# EAGLE design bluz_gw_shield_v1 (EAGLE 7.3.0)
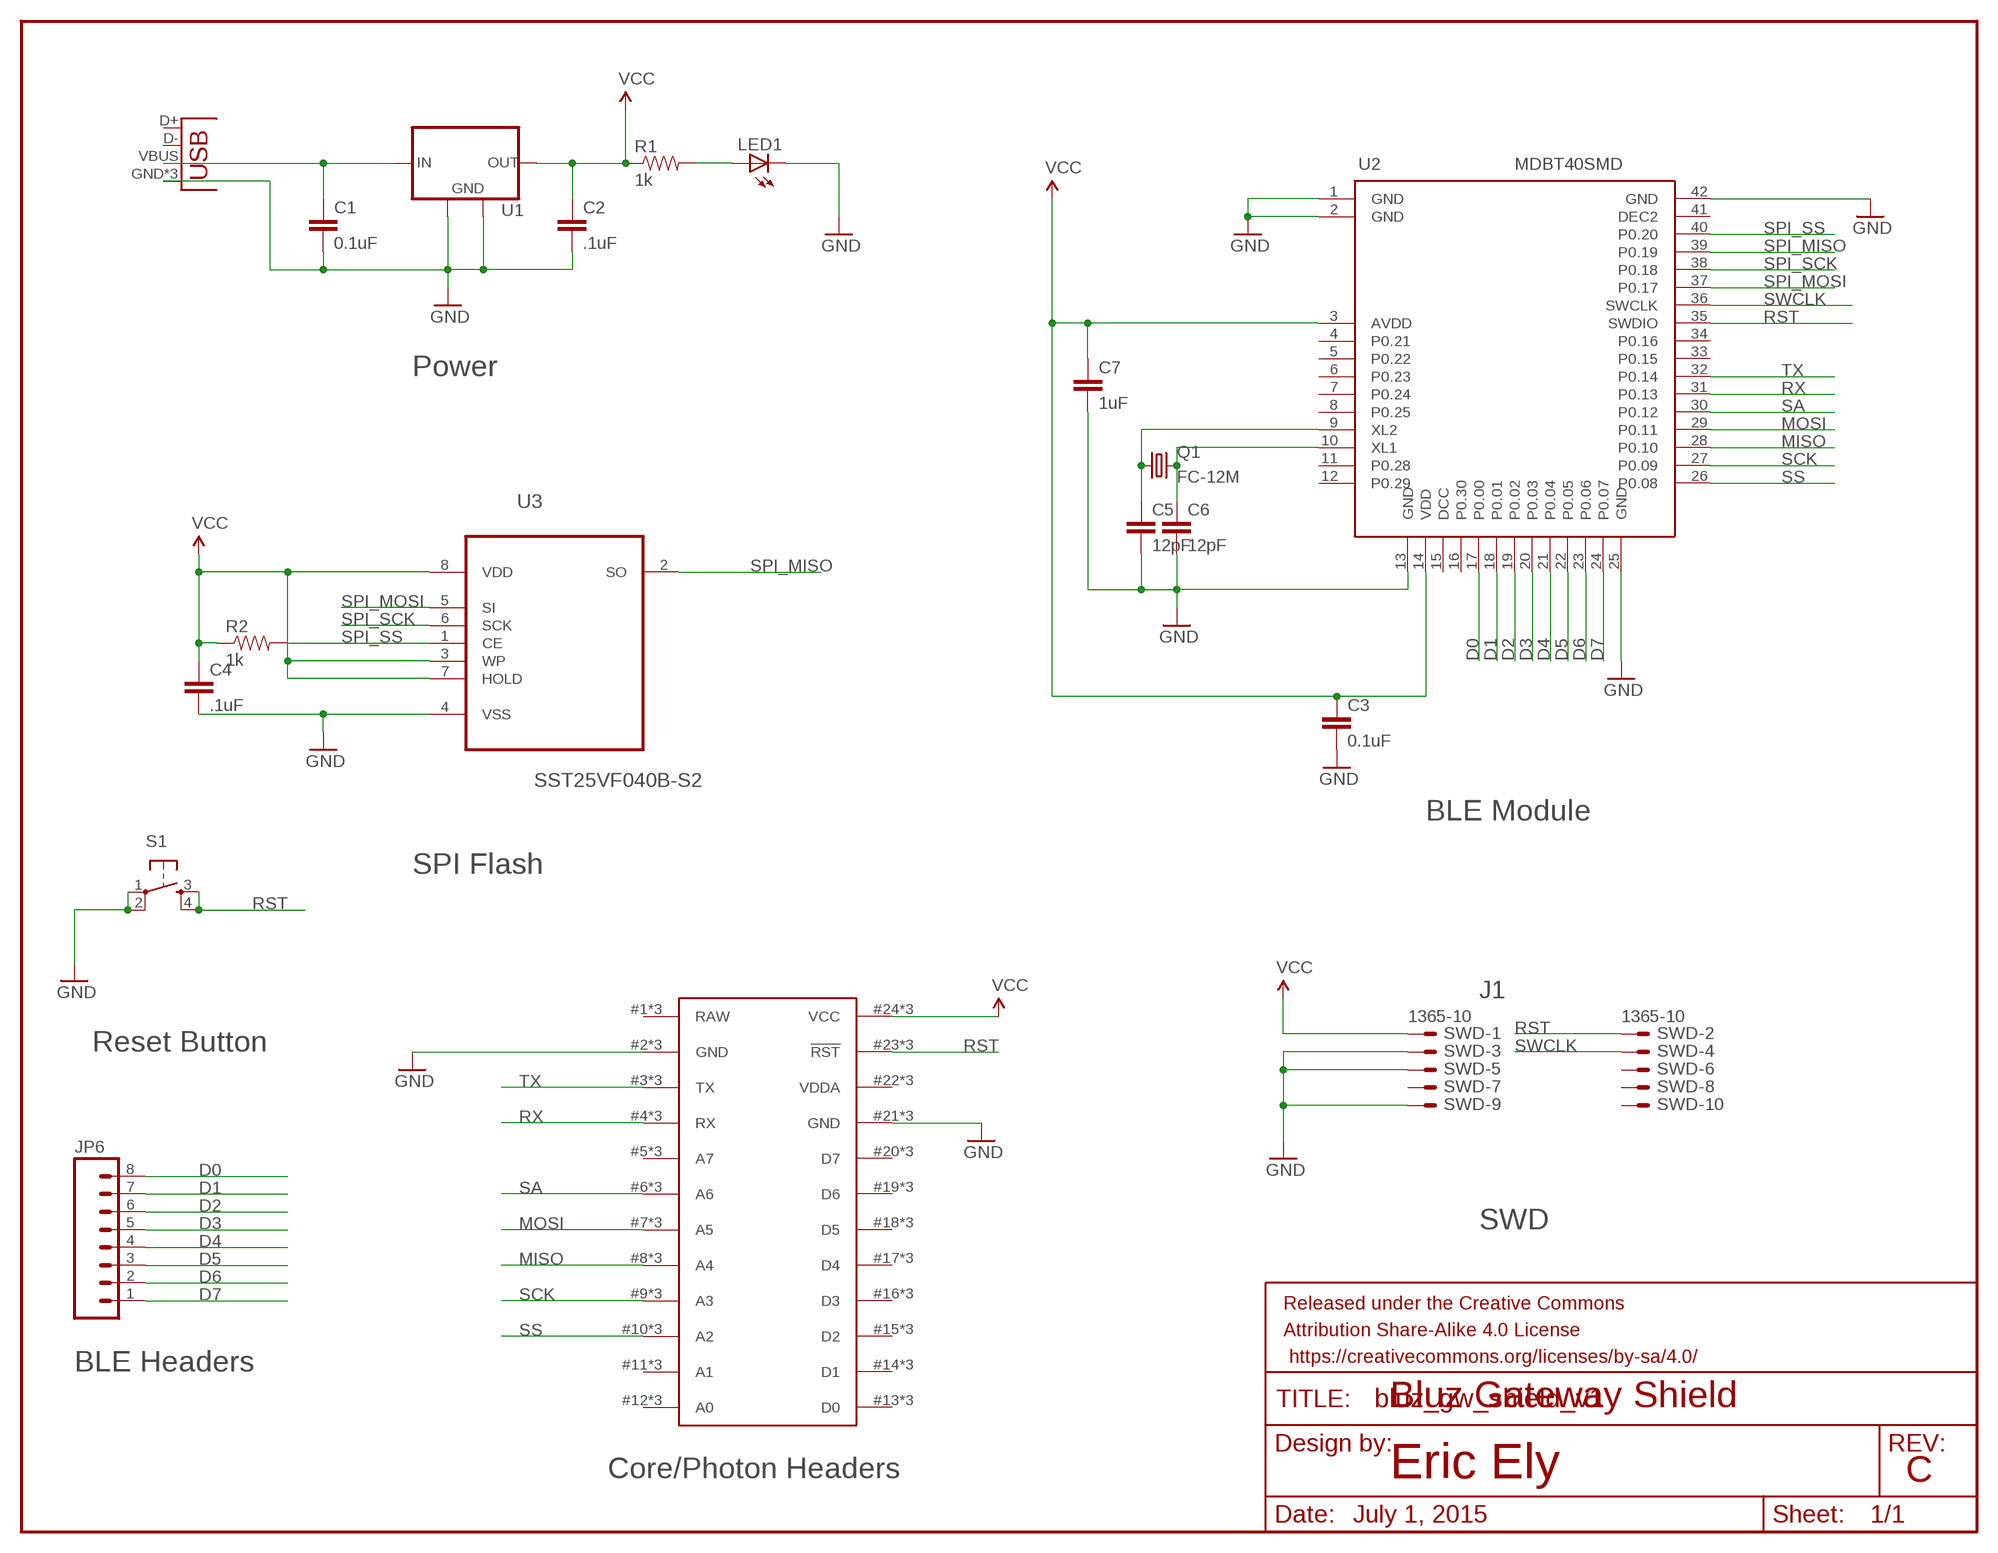
[diagram p0: schematic, sheet 1]

## Parts
C1  0.1uF  CAP0603-CAP  [0603-CAP]
C2  .1uF  CAP0603-CAP  [0603-CAP]
C3  0.1uF  CAP0603-CAP  [0603-CAP]
C4  .1uF  CAP0603-CAP  [0603-CAP]
C5  12pF  CAP0603-CAP  [0603-CAP]
C6  12pF  CAP0603-CAP  [0603-CAP]
C7  1uF  CAP0603-CAP  [0603-CAP]
FRAME1  FRAME-LETTER  [CREATIVE_COMMONS]
J2  USB-MICROB  [USB-MICROB]
JP6  M081X08  [1X08]
LED1  LEDCHIP-LED0603  [CHIP-LED0603]
Q1  FC-12M  [FC-12M]
R1  1k  RESISTOR0603-RES  [0603-RES]
R2  1k  RESISTOR0603-RES  [0603-RES]
S1  TAC_SWITCHSMD  [TACTILE_SWITCH_SMD]
SWD  1365-10  [1365-10]
U1  MCP1825S-SOT223  [SOT223]
U2  MDBT40SMD  [MDBT40]
U3  SST25VF040B-S2  [SOIC127P790X216-8N]
U4  SPARK_CORE  [SPARK_CORE_STACKABLE]

## Nets
D0: JP6.8 U2.17(P0.00)
D1: JP6.7 U2.18(P0.01)
D2: JP6.6 U2.19(P0.02)
D3: JP6.5 U2.20(P0.03)
D4: JP6.4 U2.21(P0.04)
D5: JP6.3 U2.22(P0.05)
D6: JP6.2 U2.23(P0.06)
D7: JP6.1 U2.24(P0.07)
GND: C1.2 C2.2 C3.2 C4.2 C5.2 C6.2 C7.2 J2.GND J2.MT1(GND) J2.MT2(GND) LED1.C S1.1 S1.2 SWD.3 SWD.5 SWD.9 U1.2(GND) U1.4(GND) U2.1(GND) U2.2(GND) U2.13(GND) U2.25(GND) U2.42(GND) U3.4(VSS) U4.2(GND) U4.21(GND) U4.#2(GND) U4.#21(GND) U4.@2(GND) U4.@21(GND)
MISO: U2.28(P0.10) U4.8(A4) U4.#8(A4) U4.@8(A4)
MOSI: U2.29(P0.11) U4.7(A5) U4.#7(A5) U4.@7(A5)
N$1: C1.1 J2.VBUS U1.1(IN)
N$5: LED1.A R1.2
N$7: C5.1 Q1.1 U2.9(XL2)
N$8: C6.1 Q1.2 U2.10(XL1)
RST: S1.3 S1.4 SWD.2 U2.35(SWDIO) U4.23(!RST) U4.#23(!RST) U4.@23(!RST)
RX: U2.31(P0.13) U4.4(RX) U4.#4(RX) U4.@4(RX)
SA: U2.30(P0.12) U4.6(A6) U4.#6(A6) U4.@6(A6)
SCK: U2.27(P0.09) U4.9(A3) U4.#9(A3) U4.@9(A3)
SPI_MISO: U2.39(P0.19) U3.2(SO)
SPI_MOSI: U2.37(P0.17) U3.5(SI)
SPI_SCK: U2.38(P0.18) U3.6(SCK)
SPI_SS: R2.2 U2.40(P0.20) U3.1(CE)
SS: U2.26(P0.08) U4.10(A2) U4.#10(A2) U4.@10(A2)
SWCLK: SWD.4 U2.36(SWCLK)
TX: U2.32(P0.14) U4.3(TX) U4.#3(TX) U4.@3(TX)
VCC: C2.1 C3.1 C4.1 C7.1 R1.1 R2.1 SWD.1 U1.3(OUT) U2.3(AVDD) U2.14(VDD) U3.3(WP) U3.7(HOLD) U3.8(VDD) U4.24(VCC) U4.#24(VCC) U4.@24(VCC)
Unconnected: J2.D+ J2.D- SWD.6 SWD.7 SWD.8 SWD.10 U2.4(P0.21) U2.5(P0.22) U2.6(P0.23) U2.7(P0.24) U2.8(P0.25) U2.11(P0.28) U2.12(P0.29) U2.15(DCC) U2.16(P0.30) U2.33(P0.15) U2.34(P0.16) U2.41(DEC2) U4.5(A7) U4.11(A1) U4.12(A0) U4.13(D0) U4.14(D1) U4.15(D2) U4.16(D3) U4.17(D4) U4.18(D5) U4.19(D6) U4.20(D7) U4.#5(A7) U4.#11(A1) U4.#12(A0) U4.#13(D0) U4.#14(D1) U4.#15(D2) U4.#16(D3) U4.#17(D4) U4.#18(D5) U4.#19(D6) U4.#20(D7) U4.@5(A7) U4.@11(A1) U4.@12(A0) U4.@13(D0) U4.@14(D1) U4.@15(D2) U4.@16(D3) U4.@17(D4) U4.@18(D5) U4.@19(D6) U4.@20(D7)

## Notes on the sheet
- Power
- BLE Module
- SPI Flash
- J1
- Reset Button
- SWD
- BLE Headers
- Bluz Gateway Shield
- Core/Photon Headers | Eric Ely | C
- July 1, 2015

## Power pins joined to a net without a drawn wire
RAW: U4.1(RAW) U4.#1(RAW) U4.@1(RAW)
VDDA: U4.22(VDDA) U4.#22(VDDA) U4.@22(VDDA)

## Library data of the parts
C1 C5 C6 = SparkFun-Passives:CAP: Capacitor Standard 0603 ceramic capacitor, and 0.1" leaded capacitor.
C2-C4 C7 = SparkFun-Capacitors:CAP: Capacitor Standard 0603 ceramic capacitor, and 0.1" leaded capacitor.
FRAME1 = SparkFun-Aesthetics:FRAME-LETTER: Schematic Frame Standard 8.5x11 US Letter frame
J2 = SparkFun-Connectors:USB: USB Connectors USB-B-PTH is fully proven SKU : PRT-00139/CONN-08278 USB-miniB is fully proven SKU : PRT-00587 USB-A-PCB is untested. USB-A-H is throughly reviewed, but untested. Spark Fun Electronics SKU : PRT-00437 USB-B-SMT is throughly reviewed, but untested. Needs silkscreen touching up. USB-A-S has not been used/tested USB-MB-H has not been used/tested USB-MICROB has been used. CONN-09505; PROD_ID: CONN-09505
JP6 = SparkFun-Connectors:M08: Header 8 Standard 8-pin 0.1" header. Use with straight break away headers (SKU : PRT-00116), right angle break away headers (PRT-00553), swiss pins (PRT-00743), machine pins (PRT-00117), and female headers (PRT-00115).
LED1 = led:LED: LED OSRAM: - CHIPLED LG R971, LG N971, LY N971, LG Q971, LY Q971, LO R971, LY R971 LH N974, LH R974 LS Q976, LO Q976, LY Q976 LO Q996 - Hyper CHIPLED LW Q18S LB Q993, LB Q99A, LB R99A - SideLED LS A670, LO A670, LY A670, LG A670, LP A670 LB A673, LV A673, LT A673, LW A673 LH A674 LY A675 LS A676, LA A676, LO A676, LY A676, LW A676 LS A679, LY A679, LG A679 - Hyper Micro SIDELED® LS Y876, LA Y876, LO Y876, LY Y876 LT Y87S - SmartLED LW L88C, LW L88S LB L89C, LB L89S, LG L890 LS L89K, LO L89K, LY L89K LS L896, LA L896, LO L896, LY L896 - TOPLED LS T670, LO T670, LY T670, LG T670, LP T670 LSG T670, LSP T670, LSY T670, LOP T670, LYG T670 LG T671, LOG T671, LSG T671 LB T673, LV T673, LT T673, LW T673 LH T674 LS T676, LA T676, LO T676, LY T676, LB T676, LH T676, LSB T676, LW T676 LB T67C, LV T67C, LT T67C, LS T67K, LO T67K, LY T67K, LW E67C LS E67B, LA E67B, LO E67B, LY E67B, LB E67C, LV E67C, LT E67C LW T67C LS T679, LY T679, LG T679 LS T770, LO T770, LY T770, LG T770, LP T770 LB T773, LV T773, LT T773, LW T773 LH T774 LS E675, LA E675, LY E675, LS T675 LS T776, LA T776, LO T776, LY T776, LB T776 LHGB T686 LT T68C, LB T68C - Hyper Mini TOPLED® LB M676 - Mini TOPLED Santana® LG M470 LS M47K, LO M47K, LY M47K Source: http://www.osram.convergy.de LUXEON: - LUMILED® LXK2-PW12-R00, LXK2-PW12-S00, LXK2-PW14-U00, LXK2-PW14-V00 LXK2-PM12-R00, LXK2-PM12-S00, LXK2-PM14-U00 LXK2-PE12-Q00, LXK2-PE12-R00, LXK2-PE12-S00, LXK2-PE14-T00, LXK2-PE14-U00 LXK2-PB12-K00, LXK2-PB12-L00, LXK2-PB12-M00, LXK2-PB14-N00, LXK2-PB14-P00, LXK2-PB14-Q00 LXK2-PR12-L00, LXK2-PR12-M00, LXK2-PR14-Q00, LXK2-PR14-R00 LXK2-PD12-Q00, LXK2-PD12-R00, LXK2-PD12-S00 LXK2-PH12-R00, LXK2-PH12-S00 LXK2-PL12-P00, LXK2-PL12-Q00, LXK2-PL12-R00 Source: www.luxeon.com KINGBRIGHT: KA-3528ASYC Source: www.kingbright.com
Q1 = crystal:FC-12M: kHz RANGE CRYSTAL UNIT LOW PROFILE SMD Source: Epson Toyocom FC-12M.pdf
R1 R2 = SparkFun-Passives:RESISTOR: Resistor Basic schematic elements and footprints for 0603, 1206, and PTH resistors.
S1 = Spark:TAC_SWITCH: SMD Tactiile Switch
SWD = con-leotronics:1365-10: DUAL ROW STRAIGHT HEADER 1364 SERIES. 1.27mm x 1.27mm. Without Fixing Post. SMT Source: http://www.leotronics.co.uk/Conexcon/Data%20Sheets/sec.%20A/1364ing.pdf; OC_FARNELL: unknown; OC_NEWARK: unknown
U1 = Spark:MCP1825S: 500 mA, Low Voltage, Low Quiescent Current LDO Regulator
U2 = MDBT40:MDBT40
U3 = Spark:SST25VF040B: 4 Mbit SPI Serial Flash
U4 = Spark:SPARK_CORE

## Board
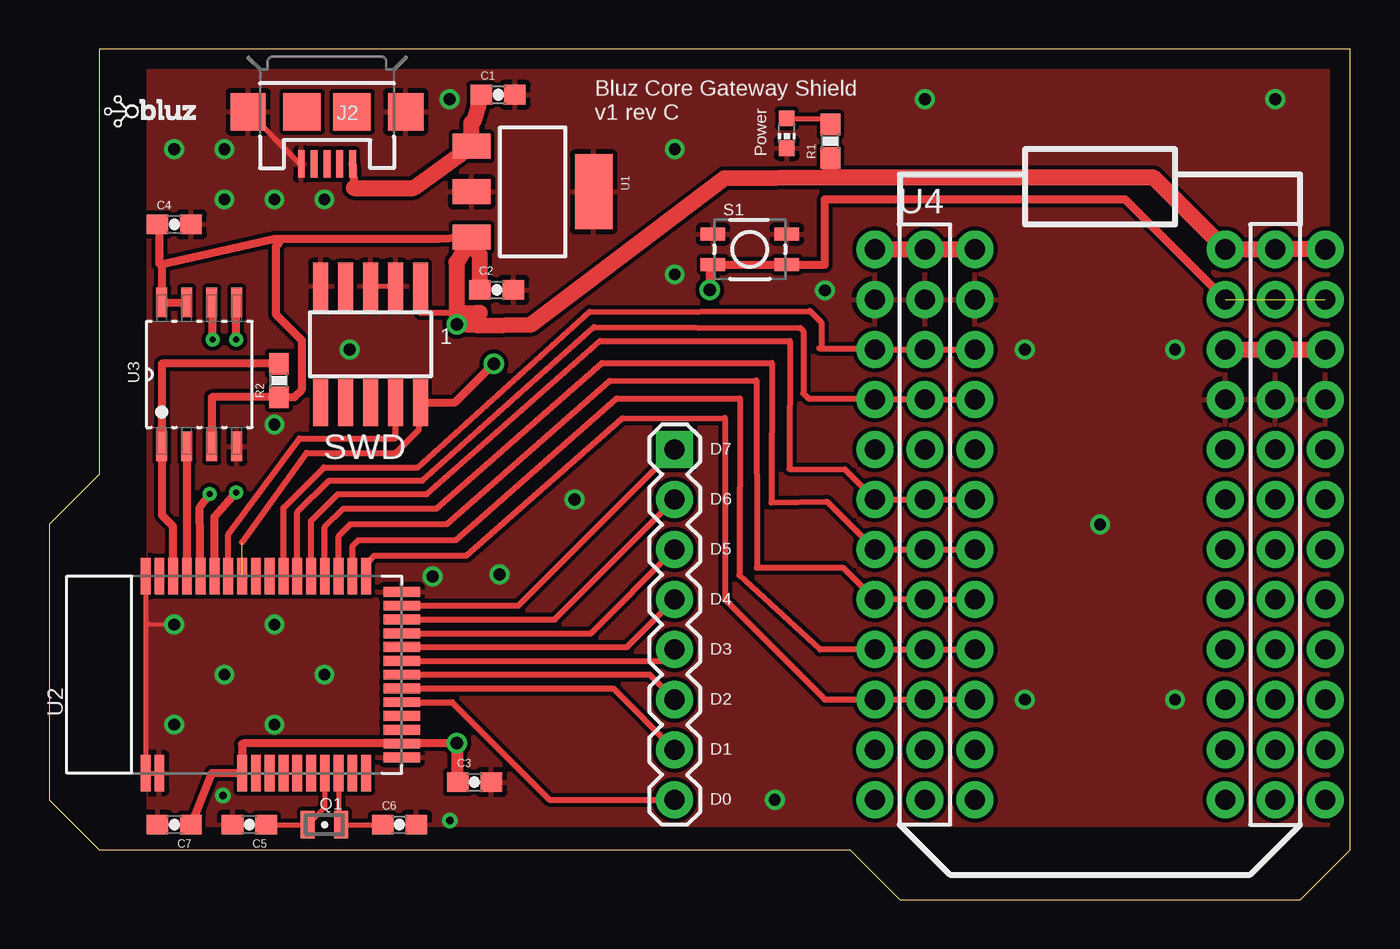
[diagram p1: board, top side]
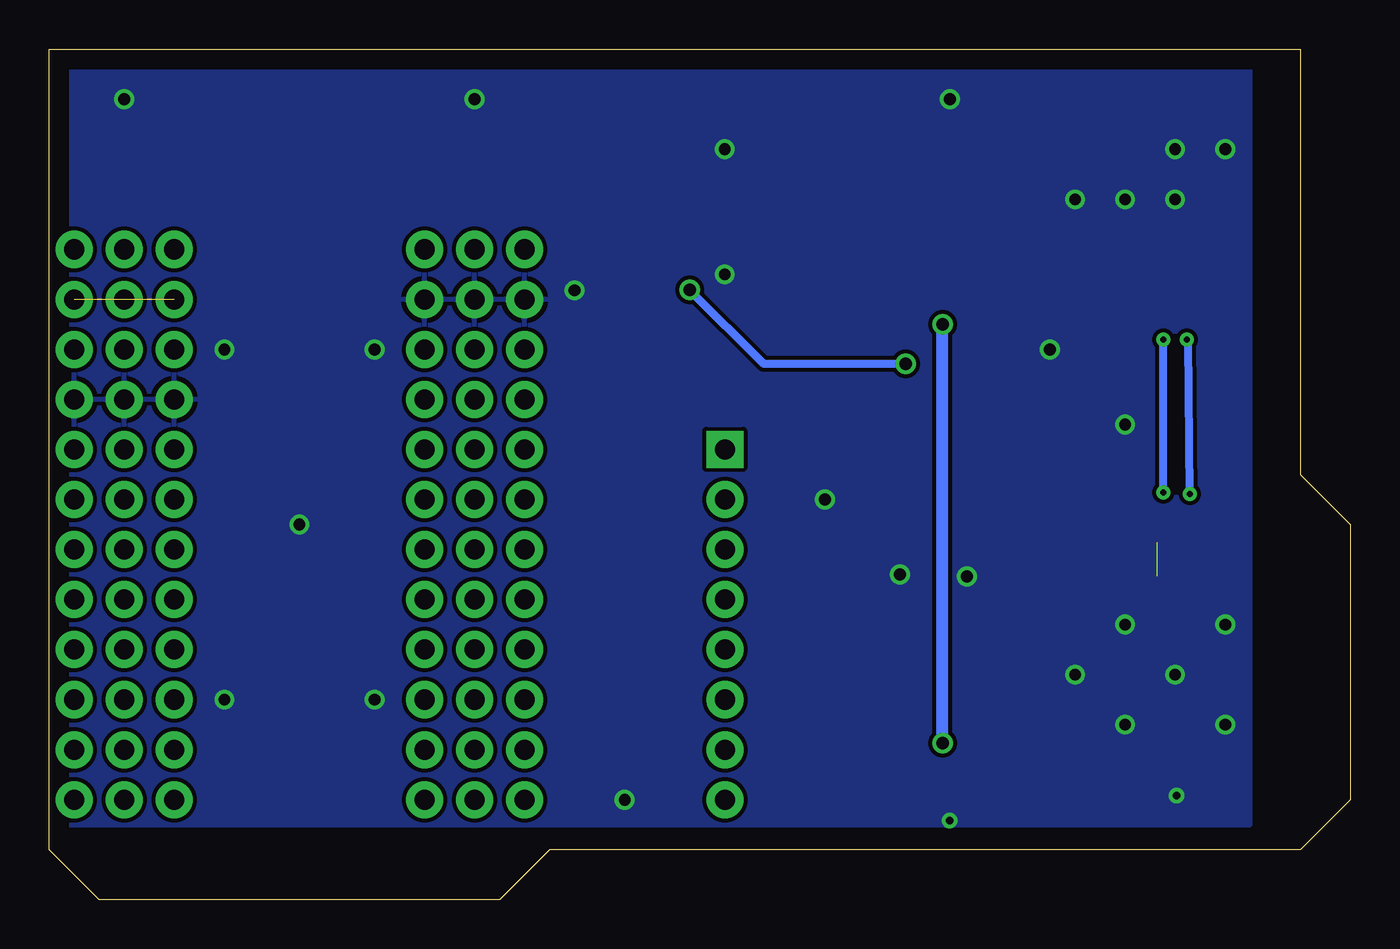
[diagram p2: board, bottom side, seen from below]

Size 66.04 x 43.18 mm. Coordinates in mm from the lower left corner, seen from the top.
Outline: 2.54,2.54 40.64,2.54 43.18,0 63.5,0 66.04,2.54 66.04,43.18 2.54,43.17 2.54,21.59 0,19.05 0,5.08 2.54,2.54
Copper layers (1*16): Top 0.035mm / dielectric 1.5mm / Bottom 0.035mm
Design rules "default *": minimum track width 10mil, minimum drill 24mil, track to track 8mil, track to pad 8mil, pad to pad 8mil, via to via 8mil, smd to smd 8mil, copper to edge 40mil, drill to drill 8mil, minimum pad ring 10mil, minimum via ring 8mil, stop-mask expansion 4mil, vias tented up to drill 25mil, thermal gap 10mil

### Footprints (pad centres in the part's own frame; a part is rotated, then mirrored left to right if it is on the bottom)
0603-CAP = smd 1.1 x 1: 1 -0.85,0; 2 0.85,0
USB-MICROB = smd 0.35 x 1.4: D+ 0,2.65; D- -0.65,2.65; GND 1.3,2.65; ID 0.65,2.65; VBUS -1.3,2.65 | smd 1.8 x 1.9: MT1 -4,0; MT2 4,0 | smd 1.9 x 1.9: P$1 -1.27,0; P$2 1.27,0
1X08 = drill 1.016 pad 1.88 square: 1 0,0 | drill 1.016 pad 1.88: 2 2.54,0; 3 5.08,0; 4 7.62,0; 5 10.16,0; 6 12.7,0; 7 15.24,0; 8 17.78,0
CHIP-LED0603 = smd 0.8 x 0.8: A 0,-0.75; C 0,0.75
FC-12M = smd 0.7 x 1.4: 1 -0.85,0; 2 0.85,0
0603-RES = smd 1.1 x 1: 1 -0.85,0; 2 0.85,0
TACTILE_SWITCH_SMD = smd 1.25 x 0.65: 1 -1.875,0.775; 2 1.875,0.775; 3 -1.875,-0.775; 4 1.875,-0.775
1365-10 = smd 0.76 x 2.4: 1 -2.54,-2.95; 2 -2.54,2.95; 3 -1.27,-2.95; 4 -1.27,2.95; 5 0,-2.95; 6 0,2.95; 7 1.27,-2.95; 8 1.27,2.95; 9 2.54,-2.95; 10 2.54,2.95
SOT223 = smd 1.27 x 1.905: 1 -2.311,-3.099; 2 0,-3.099; 3 2.311,-3.099 | smd 3.81 x 1.905: 4 0,3.099
MDBT40 = smd 1.85 x 0.5: 1 -5,4; 2 -5,3.3; 3 -5,-0.9; 4 -5,-1.6; 5 -5,-2.3; 6 -5,-3; 7 -5,-3.7; 8 -5,-4.4; 9 -5,-5.1; 10 -5,-5.8; 11 -5,-6.5; 12 -5,-7.2; 26 5,-7.2; 27 5,-6.5; 28 5,-5.8; 29 5,-5.1; 30 5,-4.4; 31 5,-3.7; 32 5,-3; 33 5,-2.3; 34 5,-1.6; 35 5,-0.9; 36 5,-0.2; 37 5,0.5; 38 5,1.2; 39 5,1.9; 40 5,2.6; 41 5,3.3; 42 5,4 | smd 0.5 x 1.85: 13 -4.2,-9; 14 -3.5,-9; 15 -2.8,-9; 16 -2.1,-9; 17 -1.4,-9; 18 -0.7,-9; 19 0,-9; 20 0.7,-9; 21 1.4,-9; 22 2.1,-9; 23 2.8,-9; 24 3.5,-9; 25 4.2,-9
SOIC127P790X216-8N = smd 1.499 x 0.559: 1 -3.658,1.905; 2 -3.658,0.635; 3 -3.658,-0.635; 4 -3.658,-1.905; 5 3.658,-1.905; 6 3.658,-0.635; 7 3.658,0.635; 8 3.658,1.905
SPARK_CORE_STACKABLE = drill 1.016 pad 1.88: 1 -8.89,13.97; 2 -8.89,11.43; 3 -8.89,8.89; 4 -8.89,6.35; 5 -8.89,3.81; 6 -8.89,1.27; 7 -8.89,-1.27; 8 -8.89,-3.81; 9 -8.89,-6.35; 10 -8.89,-8.89; 11 -8.89,-11.43; 12 -8.89,-13.97; 13 8.89,-13.97; 14 8.89,-11.43; 15 8.89,-8.89; 16 8.89,-6.35; 17 8.89,-3.81; 18 8.89,-1.27; 19 8.89,1.27; 20 8.89,3.81; 21 8.89,6.35; 22 8.89,8.89; 23 8.89,11.43; 24 8.89,13.97; #1 -6.35,13.97; #2 -6.35,11.43; #3 -6.35,8.89; #4 -6.35,6.35; #5 -6.35,3.81; #6 -6.35,1.27; #7 -6.35,-1.27; #8 -6.35,-3.81; #9 -6.35,-6.35; #10 -6.35,-8.89; #11 -6.35,-11.43; #12 -6.35,-13.97; #13 11.43,-13.97; #14 11.43,-11.43; #15 11.43,-8.89; #16 11.43,-6.35; #17 11.43,-3.81; #18 11.43,-1.27; #19 11.43,1.27; #20 11.43,3.81; #21 11.43,6.35; #22 11.43,8.89; #23 11.43,11.43; #24 11.43,13.97; @1 -11.43,13.97; @2 -11.43,11.43; @3 -11.43,8.89; @4 -11.43,6.35; @5 -11.43,3.81; @6 -11.43,1.27; @7 -11.43,-1.27; @8 -11.43,-3.81; @9 -11.43,-6.35; @10 -11.43,-8.89; @11 -11.43,-11.43; @12 -11.43,-13.97; @13 6.35,-13.97; @14 6.35,-11.43; @15 6.35,-8.89; @16 6.35,-6.35; @17 6.35,-3.81; @18 6.35,-1.27; @19 6.35,1.27; @20 6.35,3.81; @21 6.35,6.35; @22 6.35,8.89; @23 6.35,11.43; @24 6.35,13.97

### Placement (x,y rotation side)
C1  22.78,40.87 0 top
C2  22.71,30.96 0 top
C3  21.59,5.97 0 top
C4  6.35,34.29 0 top
C5  10.16,3.81 180 top
C6  17.78,3.81 0 top
C7  6.35,3.81 180 top
FRAME1  21.59,-16.51 0 top  (outside the outline)
J2  14.1,40.01 180 top
JP6  31.75,22.86 270 top
LED1  37.44,38.91 180 top
Q1  13.97,3.81 0 top
R1  39.65,38.51 90 top
R2  11.66,26.37 90 top
S1  35.56,33.02 0 top
SWD  16.31,28.19 180 top
U1  24.54,35.94 270 top
U2  8.89,11.43 90 top
U3  7.62,26.67 90 top
U4  53.34,19.05 0 top
U$2  [BLUZE_LOGO_LOW_RES]  2.79,39.24 0 top

### Tracks (layer width: path | path; a pad name or v marks a point on that pad's centre or on a via)
D0
  Top 0.305: U2.17 20.45,10.03 25.4,5.08 JP6.8
D1
  Top 0.305: U2.18 28.64,10.73 JP6.7
D2
  Top 0.305: U2.19 30.48,11.43 JP6.6
D3
  Top 0.305: U2.20 31.18,12.13 JP6.5
D4
  Top 0.305: U2.21 29.34,12.83 JP6.4
D5
  Top 0.305: U2.22 27.5,13.53 JP6.3
D6
  Top 0.305: U2.23 25.66,14.23 JP6.2
D7
  Top 0.305: U2.24 23.82,14.93 JP6.1
GND  (via drill 0.38, 0.6)
  Top 0.203: U2.42 4.89,14.16 5.08,13.97 v6.35,13.97
  Top 0.254: SWD.5 SWD.3 | U2.2 U2.1 U2.42 | 17.4,40.77 17.97,40.2 17.76,40.19 17.95,40.01 J2.MT1 | J2.GND 12.75,37.35 J2.MT2
  other vias: 31.75,31.75 39.37,30.94 49.53,27.94 57.15,27.94 49.53,10.16 57.15,10.16 36.83,5.08 6.35,8.89 11.43,13.97 13.97,11.43 11.43,8.89 8.89,11.43 6.35,38.1 8.89,38.1 8.89,35.56 11.43,35.56 13.97,35.56 20.32,40.64 31.75,38.1 44.45,40.64 62.23,40.64 22.86,16.51 26.67,20.32 19.46,16.41 53.34,19.05 11.43,24.13 15.24,27.94 8.81,5.28 20.35,4.01
  pour Top: 5.08,3.81 5.08,43.18 66.04,43.18 66.04,3.81
  pour Bottom: 66.04,43.18 66.04,3.81 5.08,3.81 5.08,43.18
MISO
  Top 0.305: U2.28 14.69,18.48 15.29,19.07 20.19,19.07 28.45,26.34 35.89,26.36 35.92,16.87 40.28,16.87 U4.@8 U4.8 U4.#8
MOSI
  Top 0.305: U2.29 13.99,18.92 14.94,19.86 19.66,19.86 28.07,27.25 36.68,27.25 36.65,20.17 39.47,20.22 U4.@7 U4.7 U4.#7
N$1
  Top 0.406: J2.VBUS 15.47,36.14
  Top 0.813: 15.47,36.14 18.49,36.14 U1.1 21.44,39.45 21.57,39.57 C1.1
N$5
  Top 0.254: LED1.A 39.34,39.66 R1.2
N$7
  Top 0.254: C5.1 Q1.1 13.99,4.68 U2.9
N$8
  Top 0.254: C6.1 Q1.2 14.69,3.94 U2.10
RAW
  Top 0.813: U4.@1 U4.1 U4.#1
RST  (via drill 0.64)  (3 unrouted)
  Top 0.305: 9.79,18.15 13.06,22.68 17.58,22.68 18.77,23.88 18.77,25.17 SWD.2
  Top 0.406: U4.@23 54.61,35.56 39.37,35.56 39.37,32.24 S1.4 S1.3 33.53,32.09 v33.53,30.96 | SWD.2 20.6,25.24 v22.55,27.2
  Bottom 0.406: v22.55,27.2 29.77,27.2 v33.53,30.96
RX
  Top 0.305: U2.31 12.59,19.68 14.2,21.29 18.95,21.29 27.66,29.08 38.12,29.03 38.28,28.88 38.28,25.7 38.53,25.45 41.86,25.45 U4.@4 U4.4 U4.#4
SA
  Top 0.305: U2.30 13.29,19.23 14.66,20.6 19.18,20.6 27.96,28.37 37.59,28.37 37.57,21.87 40.39,21.84 U4.@6 U4.6 U4.#6
SCK
  Top 0.305: U2.27 15.39,17.95 15.7,18.26 20.65,18.26 28.8,25.45 35.05,25.45 35.03,16.48 39.14,12.7 U4.@9 U4.9 U4.#9
SPI_MISO
  Top 0.406: U2.39 U3.2
SPI_MOSI  (via drill 0.3)
  Top 0.406: U2.37 8.39,19.44 v9.5,20.68 | v9.5,28.45 9.5,30.3 U3.5
  Bottom 0.406: v9.5,20.68 v9.5,28.45
SPI_SCK  (via drill 0.3)
  Top 0.406: U2.38 7.64,19.93 v8.15,20.6 | v8.31,28.45 8.31,30.28 U3.6
  Bottom 0.406: v8.15,20.6 8.23,28.37 v8.31,28.45
SPI_SS
  Top 0.406: U2.40 6.29,18.96 5.74,19.51 5.74,22.99 U3.1 5.71,27.21 R2.2
SS
  Top 0.305: U2.26 16.09,17.05 16.51,17.48 21.18,17.48 29.08,24.43 34.29,24.46 34.29,15.24 39.37,10.16 U4.@10 U4.10 U4.#10
SWCLK
  Top 0.305: U2.36 9.09,18.54 12.7,23.42 17.58,23.42 SWD.4
TX
  Top 0.305: U2.32 11.89,19.89 13.95,21.95 18.72,21.95 27.43,29.84 38.61,29.9 39.19,29.31 39.19,28.09 39.09,27.99 41.86,27.99 U4.@3 U4.3 U4.#3
VCC  (via drill 0.64)
  Top 0.305: 20.68,29.79 18.85,29.79 SWD.1
  Top 0.406: C4.1 5.59,34.29 5.59,32.28 5.71,32.28 | 5.71,32.28 11.43,33.55 | 11.43,33.55 19.76,33.55 U1.3 | 5.71,32.28 U3.8 U3.7 | 11.43,33.55 11.66,33.33 11.51,33.17 11.51,29.72 12.83,28.4 12.83,25.91 12.43,25.52 R2.1 8.26,25.52 U3.3 | v20.7,7.95 17.91,7.95 U2.14 9.84,7.93 9.8,7.9 9.79,7.9 U2.3 8.25,6.43 C7.1
  Top 0.61: C3.1 20.74,7.91 v20.7,7.95
  Top 0.813: 21.74,29.79 20.68,29.79 20.68,32.36 U1.3 21.59,33.48 21.59,33.02 21.86,32.75 C2.1 | 21.74,29.79 21.74,29.16 | 21.74,29.16 v20.7,29.21 | 21.86,29.79 21.74,29.79 | 21.74,29.16 24.46,29.21 34.27,36.63 39.67,36.68 | 39.67,36.68 56.03,36.68 U4.@24 U4.24 U4.#24 | R1.1 39.62,36.73 39.67,36.68
  Bottom 0.61: v20.7,7.95 v20.7,29.21
VDDA
  Top 0.813: U4.@22 U4.22 | 63.5,27.94 U4.22 | U4.22 U4.#22

### Text on the board
tPlace: Power | D7 | D6 | D5 | D4 | D3 | D2 | D1 | D0
tNames: Bluz Core Gateway Shield / v1 rev C | 1